# EAGLE design doubleSided-4x4 (EAGLE 9.0.0)
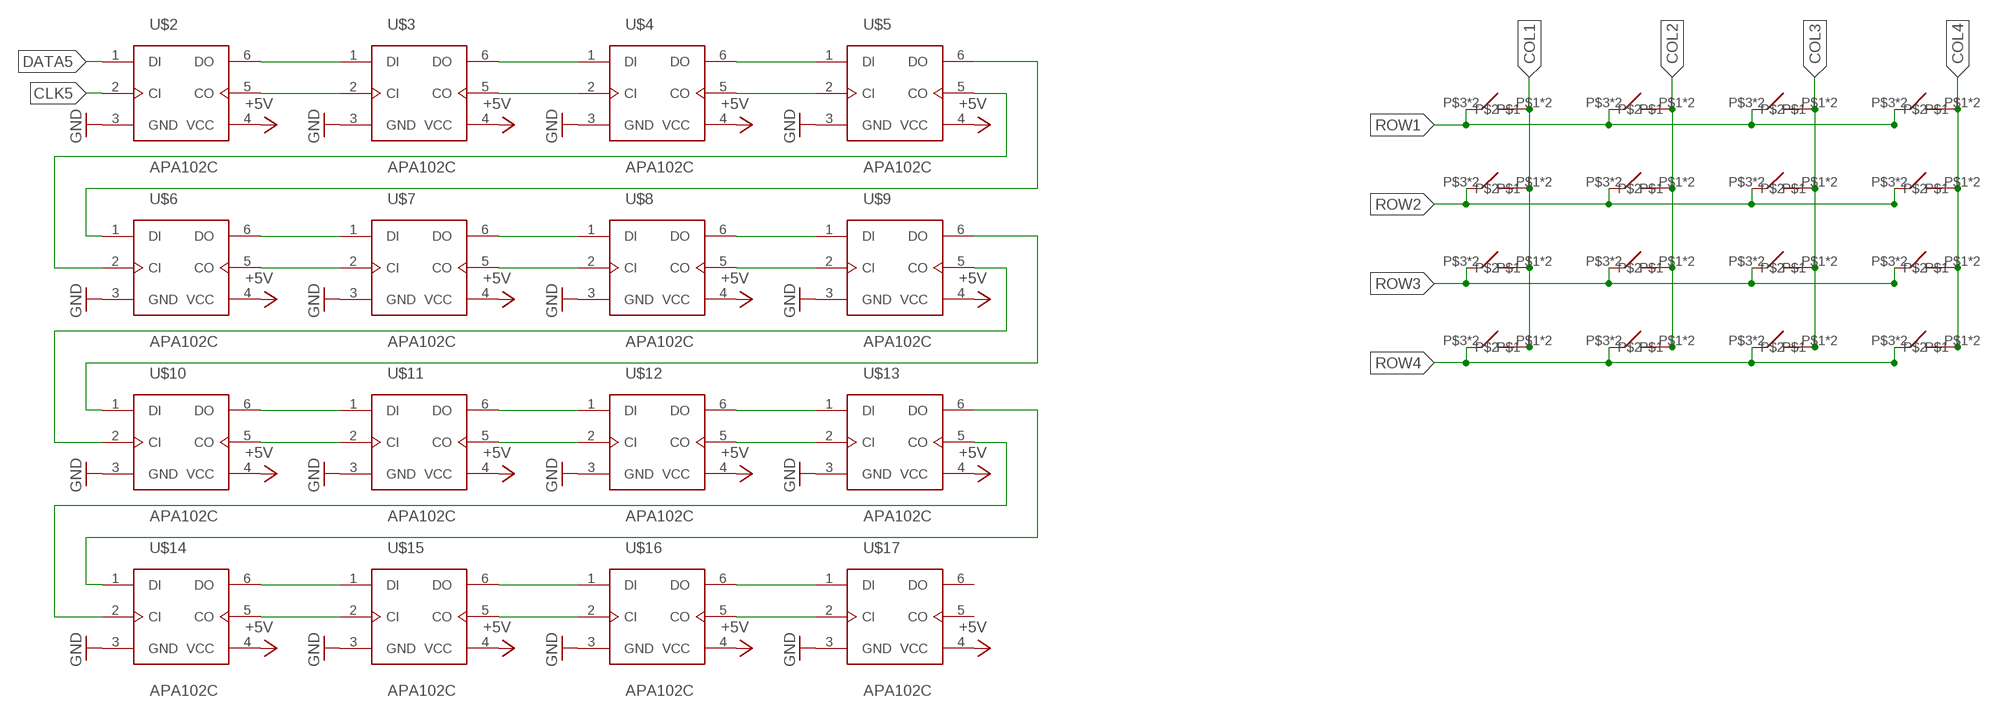
[diagram p0: schematic, sheet 1]

## Parts
U$2  APA102C  [APA102C-5050-SMD]
U$3  APA102C  [APA102C-5050-SMD]
U$4  APA102C  [APA102C-5050-SMD]
U$5  APA102C  [APA102C-5050-SMD]
U$6  APA102C  [APA102C-5050-SMD]
U$7  APA102C  [APA102C-5050-SMD]
U$8  APA102C  [APA102C-5050-SMD]
U$9  APA102C  [APA102C-5050-SMD]
U$10  APA102C  [APA102C-5050-SMD]
U$11  APA102C  [APA102C-5050-SMD]
U$12  APA102C  [APA102C-5050-SMD]
U$13  APA102C  [APA102C-5050-SMD]
U$14  APA102C  [APA102C-5050-SMD]
U$15  APA102C  [APA102C-5050-SMD]
U$16  APA102C  [APA102C-5050-SMD]
U$17  APA102C  [APA102C-5050-SMD]
U$18  SOFT-TACTILE-PUSHBUTTON  [ADAFRUIT-SOFT-TACTILE-PUSHBUTTON]
U$19  SOFT-TACTILE-PUSHBUTTON  [ADAFRUIT-SOFT-TACTILE-PUSHBUTTON]
U$20  SOFT-TACTILE-PUSHBUTTON  [ADAFRUIT-SOFT-TACTILE-PUSHBUTTON]
U$21  SOFT-TACTILE-PUSHBUTTON  [ADAFRUIT-SOFT-TACTILE-PUSHBUTTON]
U$22  SOFT-TACTILE-PUSHBUTTON  [ADAFRUIT-SOFT-TACTILE-PUSHBUTTON]
U$23  SOFT-TACTILE-PUSHBUTTON  [ADAFRUIT-SOFT-TACTILE-PUSHBUTTON]
U$24  SOFT-TACTILE-PUSHBUTTON  [ADAFRUIT-SOFT-TACTILE-PUSHBUTTON]
U$25  SOFT-TACTILE-PUSHBUTTON  [ADAFRUIT-SOFT-TACTILE-PUSHBUTTON]
U$26  SOFT-TACTILE-PUSHBUTTON  [ADAFRUIT-SOFT-TACTILE-PUSHBUTTON]
U$27  SOFT-TACTILE-PUSHBUTTON  [ADAFRUIT-SOFT-TACTILE-PUSHBUTTON]
U$28  SOFT-TACTILE-PUSHBUTTON  [ADAFRUIT-SOFT-TACTILE-PUSHBUTTON]
U$29  SOFT-TACTILE-PUSHBUTTON  [ADAFRUIT-SOFT-TACTILE-PUSHBUTTON]
U$30  SOFT-TACTILE-PUSHBUTTON  [ADAFRUIT-SOFT-TACTILE-PUSHBUTTON]
U$31  SOFT-TACTILE-PUSHBUTTON  [ADAFRUIT-SOFT-TACTILE-PUSHBUTTON]
U$32  SOFT-TACTILE-PUSHBUTTON  [ADAFRUIT-SOFT-TACTILE-PUSHBUTTON]
U$33  SOFT-TACTILE-PUSHBUTTON  [ADAFRUIT-SOFT-TACTILE-PUSHBUTTON]

## Nets
5V: U$2.4(VCC) U$3.4(VCC) U$4.4(VCC) U$5.4(VCC) U$6.4(VCC) U$7.4(VCC) U$8.4(VCC) U$9.4(VCC) U$10.4(VCC) U$11.4(VCC) U$12.4(VCC) U$13.4(VCC) U$14.4(VCC) U$15.4(VCC) U$16.4(VCC) U$17.4(VCC) ; supply symbol labelled +5V
CLK5: U$2.2(CI)
COL1: U$18.P$1 U$18.P$2 U$22.P$1 U$22.P$2 U$26.P$1 U$26.P$2 U$30.P$1 U$30.P$2
COL2: U$19.P$1 U$19.P$2 U$23.P$1 U$23.P$2 U$27.P$1 U$27.P$2 U$31.P$1 U$31.P$2
COL3: U$20.P$1 U$20.P$2 U$24.P$1 U$24.P$2 U$28.P$1 U$28.P$2 U$32.P$1 U$32.P$2
COL4: U$21.P$1 U$21.P$2 U$25.P$1 U$25.P$2 U$29.P$1 U$29.P$2 U$33.P$1 U$33.P$2
DATA5: U$2.1(DI)
GND: U$2.3(GND) U$3.3(GND) U$4.3(GND) U$5.3(GND) U$6.3(GND) U$7.3(GND) U$8.3(GND) U$9.3(GND) U$11.3(GND) U$12.3(GND) U$13.3(GND) U$15.3(GND) U$16.3(GND) U$17.3(GND)
N$1: U$2.6(DO) U$3.1(DI)
N$2: U$2.5(CO) U$3.2(CI)
N$3: U$3.5(CO) U$4.2(CI)
N$4: U$3.6(DO) U$4.1(DI)
N$5: U$4.6(DO) U$5.1(DI)
N$6: U$4.5(CO) U$5.2(CI)
N$7: U$6.6(DO) U$7.1(DI)
N$8: U$6.5(CO) U$7.2(CI)
N$9: U$7.5(CO) U$8.2(CI)
N$10: U$7.6(DO) U$8.1(DI)
N$11: U$8.6(DO) U$9.1(DI)
N$12: U$8.5(CO) U$9.2(CI)
N$13: U$5.5(CO) U$6.2(CI)
N$14: U$5.6(DO) U$6.1(DI)
N$15: U$10.6(DO) U$11.1(DI)
N$16: U$10.5(CO) U$11.2(CI)
N$17: U$11.5(CO) U$12.2(CI)
N$18: U$11.6(DO) U$12.1(DI)
N$19: U$12.6(DO) U$13.1(DI)
N$20: U$12.5(CO) U$13.2(CI)
N$21: U$14.6(DO) U$15.1(DI)
N$22: U$14.5(CO) U$15.2(CI)
N$23: U$15.5(CO) U$16.2(CI)
N$24: U$15.6(DO) U$16.1(DI)
N$25: U$16.6(DO) U$17.1(DI)
N$26: U$16.5(CO) U$17.2(CI)
N$27: U$9.5(CO) U$10.2(CI)
N$28: U$9.6(DO) U$10.1(DI)
N$29: U$13.5(CO) U$14.2(CI)
N$30: U$13.6(DO) U$14.1(DI)
ROW1: U$18.P$3 U$18.P$4 U$19.P$3 U$19.P$4 U$20.P$3 U$20.P$4 U$21.P$3 U$21.P$4
ROW2: U$22.P$3 U$22.P$4 U$23.P$3 U$23.P$4 U$24.P$3 U$24.P$4 U$25.P$3 U$25.P$4
ROW3: U$26.P$3 U$26.P$4 U$27.P$3 U$27.P$4 U$28.P$3 U$28.P$4 U$29.P$3 U$29.P$4
ROW4: U$30.P$3 U$30.P$4 U$31.P$3 U$31.P$4 U$32.P$3 U$32.P$4 U$33.P$3 U$33.P$4
Unconnected: U$17.5(CO) U$17.6(DO)

## Power pins joined to a net without a drawn wire
GND: U$10.3(GND) U$14.3(GND)

## Library data of the parts
U$2-U$17 = launchpadParts:APA102C: APA201C RGB LED using the SPI interface. 5050 SMD package Sold by Adafruit as Dotstars Resources: Datasheet <https://cdn-shop.adafruit.com/datasheets/APA102.pdf>
U$18-U$33 = launchpadParts:SOFT-TACTILE-PUSHBUTTON: Soft Tactile Button Pushbutton from Adafruit

## Board
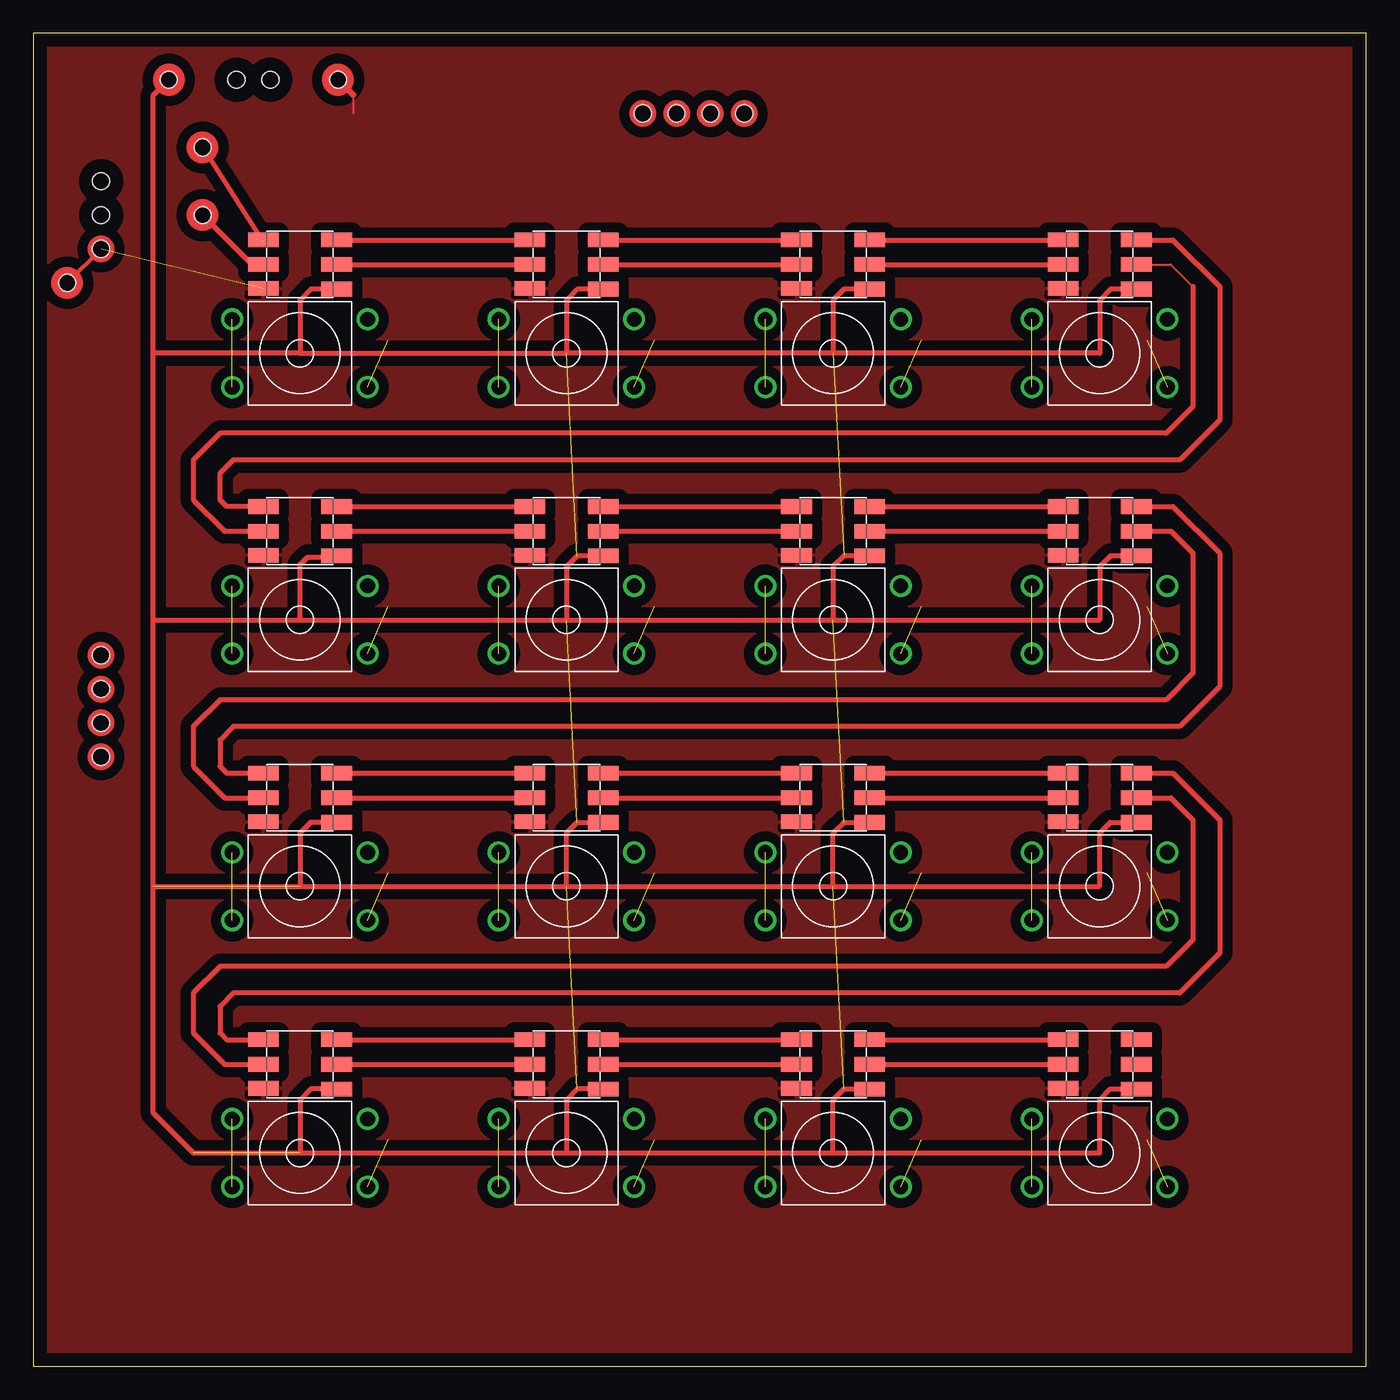
[diagram p1: board, top side]
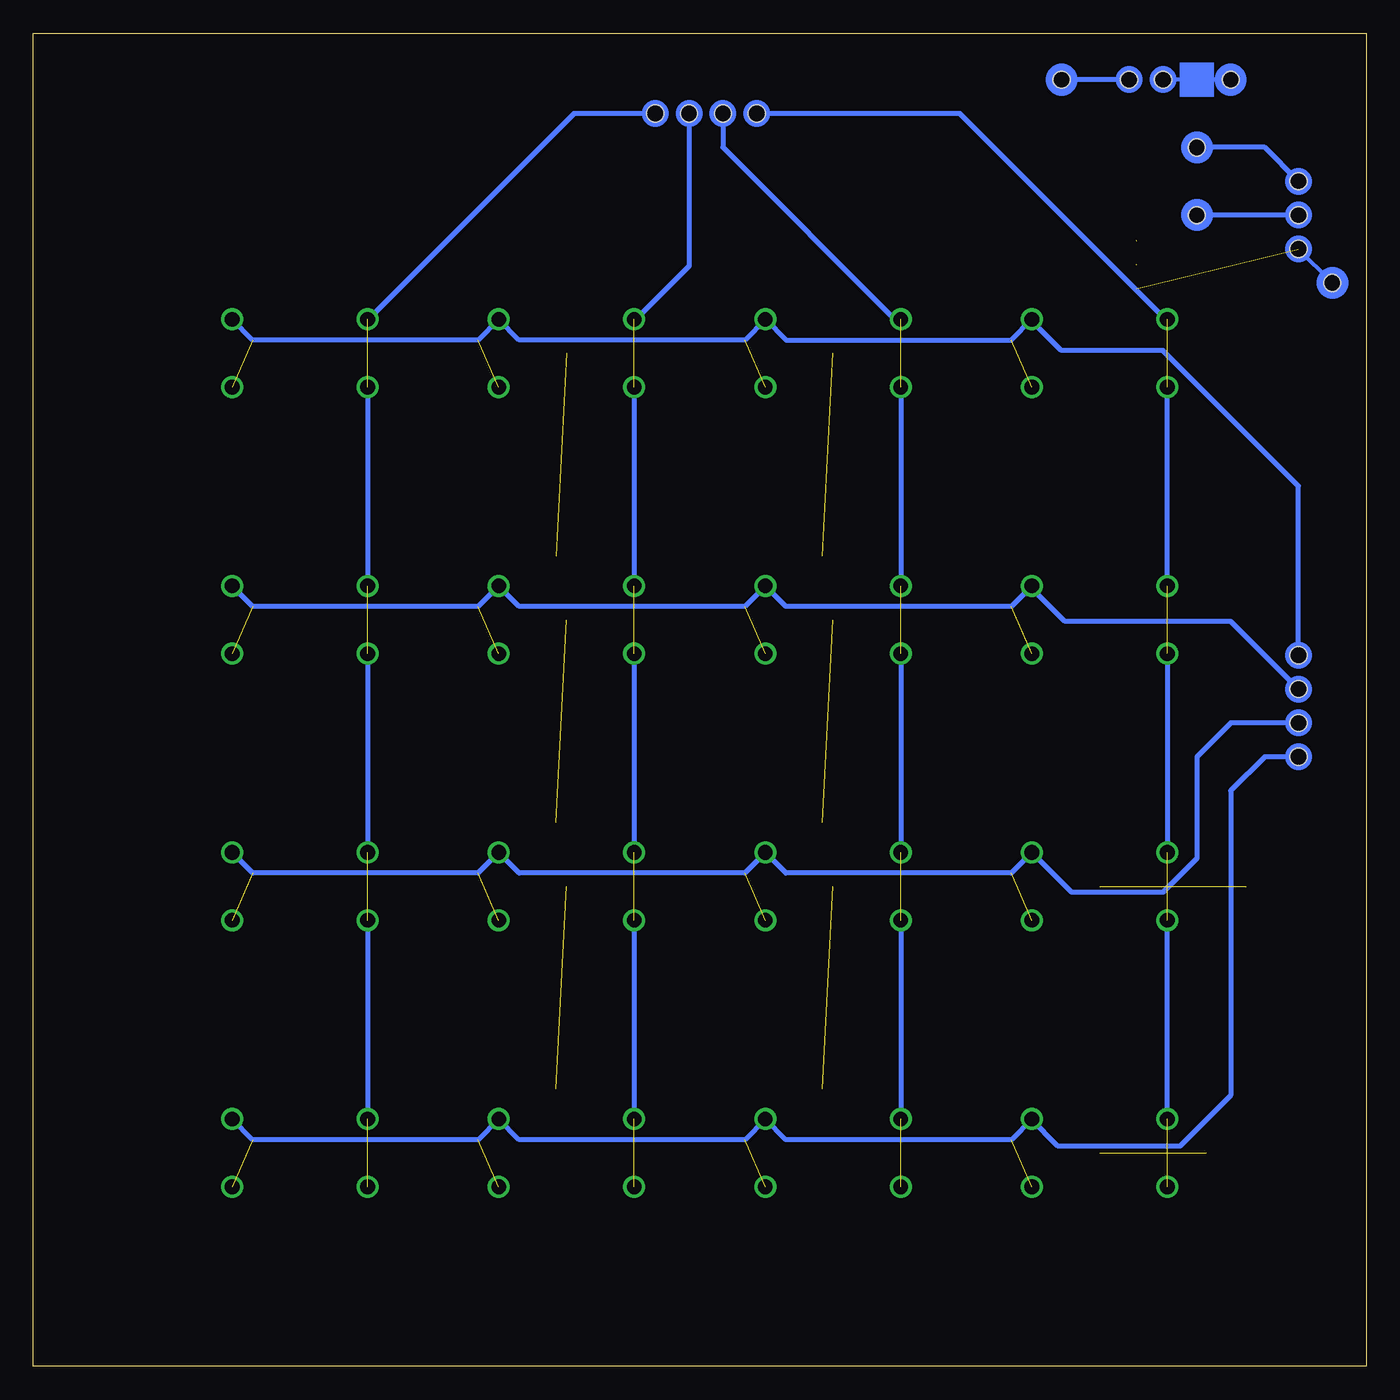
[diagram p2: board, bottom side, seen from below]

Size 100 x 100 mm. Coordinates in mm from the lower left corner, seen from the top.
Outline: 0,0 100,0 100,100 0,100 0,0
Copper layers (1*16): Top 0.035mm / dielectric 1.5mm / Bottom 0.035mm
Design rules "default *": minimum track width 6mil, minimum drill 0.35mm, track to track 30mil, track to pad 27mil, pad to pad 20mil, via to via 6mil, smd to smd 6mil, copper to edge 40mil, drill to drill 6mil, minimum pad ring 10mil, minimum via ring 8mil, stop-mask expansion 4mil, vias tented up to drill 0mil, thermal gap 10mil
Holes 1.27 mm at 53.34,93.98 5.08,53.34 5.08,50.8 50.8,93.98 48.26,93.98 45.72,93.98 5.08,45.72 5.08,48.26 15.24,96.52 17.78,96.52 5.08,88.9 5.08,86.36 5.08,83.82 10.16,96.52 22.86,96.52 12.7,91.44 12.7,86.36 2.54,81.28

### Footprints (pad centres in the part's own frame; a part is rotated, then mirrored left to right if it is on the bottom)
APA102C-5050-SMD = smd 2.3 x 1.1: 1 -2.75,1.85; 2 -2.75,0; 3 -2.75,-1.8; 4 2.75,-1.85; 5 2.75,0; 6 2.75,1.85
ADAFRUIT-SOFT-TACTILE-PUSHBUTTON = drill 1.1: P$1 -5.08,2.54; P$2 -5.08,-2.54; P$3 5.08,-2.54; P$4 5.08,2.54

### Placement (x,y rotation side)
U$2  20,82.65 0 top
U$3  40,82.65 0 top
U$4  60,82.65 0 top
U$5  80,82.65 0 top
U$6  20,62.65 0 top
U$7  40,62.65 0 top
U$8  60,62.65 0 top
U$9  80,62.65 0 top
U$10  20,42.65 0 top
U$11  40,42.65 0 top
U$12  60,42.65 0 top
U$13  80,42.65 0 top
U$14  20,22.65 0 top
U$15  40,22.65 0 top
U$16  60,22.65 0 top
U$17  80,22.65 0 top
U$18  20,76 0 top
U$19  40,76 0 top
U$20  60,76 0 top
U$21  80,76 0 top
U$22  20,56 0 top
U$23  40,56 0 top
U$24  60,56 0 top
U$25  80,56 0 top
U$26  20,36 0 top
U$27  40,36 0 top
U$28  60,36 0 top
U$29  80,36 0 top
U$30  20,16 0 top
U$31  40,16 0 top
U$32  60,16 0 top
U$33  80,16 0 top

### Tracks (layer width: path | path; a pad name or v marks a point on that pad's centre or on a via)
5V  (via drill 0.35)  (8 unrouted)
  Top 0.152: U$6.4 20.8,60.8 20,60
  Top 0.381: U$2.4 20.8,80.8 20,80 20,76 | 20,76 40,76 | 40,76 40,80 40.8,80.8 U$3.4 | U$4.4 60.8,80.8 60,80 60,76 | 60,76 40,76 | 60,76 80,76 80,80 80.8,80.8 U$5.4 | U$9.4 80.8,60.8 80,60 80,56 20,56 | U$8.4 60.8,60.8 60,60 60,56 | U$7.4 40.8,60.8 40,60 40,56 | U$10.4 20.8,40.8 20,40 20,36 | U$13.4 80.8,40.8 80,40 80,36 9,36 | 60,36 60,40 60.8,40.8 U$12.4 | 40,36 40,40 40.8,40.8 U$11.4 | U$14.4 20.8,20.8 20,20 20,16 | U$17.4 80.8,20.8 80,20 80,16 12,16 9,19 9,36 | 60,16 60,20 60.8,20.8 U$16.4 | U$15.4 40.8,20.8 40,20 40,16 | 9,36 9,56 | 9,56 9,76 | 9,76 9,95.36 v10.16,96.52 | 20,76 9,76 | 9,56 20,56 | 20,56 20,60 20,60.13 20.57,60.71 22.61,60.71
  Bottom 0.3: v10.16,96.52 15.24,96.52
  pour Bottom: 11.43,97.79 11.43,95.25 13.97,95.25 13.97,97.79
CLK5  (via drill 0.35)  (1 unrouted)
  Top 0.152: 16.46,82.6 17.2,82.6
  Top 0.381: v12.7,86.36 16.46,82.6
  Bottom 0.381: 5.08,86.36 v12.7,86.36
COL1  (4 unrouted)
  Bottom 0.381: U$30.P$1 U$26.P$2 | U$22.P$2 U$26.P$1 | U$22.P$1 U$18.P$2
COL2  (4 unrouted)
  Bottom 0.381: U$19.P$2 U$23.P$1 | U$27.P$2 U$31.P$1 | U$23.P$2 U$27.P$1
COL3  (4 unrouted)
  Bottom 0.381: U$20.P$2 U$24.P$1 | U$28.P$2 U$32.P$1 | U$24.P$2 U$28.P$1
COL4  (4 unrouted)
  Bottom 0.381: U$21.P$2 U$25.P$1 | U$29.P$2 U$33.P$1 | U$25.P$2 U$29.P$1
DATA5  (via drill 0.35)  (1 unrouted)
  Top 0.381: v12.7,91.44 17.2,84.4
  Bottom 0.381: 5.08,88.9 7.62,91.44 v12.7,91.44
GND  (via drill 0.35)  (1 unrouted)
  Top 0.152: 24,95.38 24,94
  Top 0.3: 5.08,83.82 v2.54,81.28
  Top 0.5: v22.86,96.52 24,95.38
  Bottom 0.3: v2.54,81.28 5.08,83.82
  Bottom 0.381: 17.78,96.52 v22.86,96.52
  pour Top: -1,0 0,-1 100,-1 101,0 101,100 100,101 0,101 -1,100
N$1
  Top 0.381: U$2.6 U$3.1
N$2
  Top 0.381: U$2.5 U$3.2
N$3
  Top 0.381: U$3.5 U$4.2
N$4
  Top 0.381: U$3.6 U$4.1
N$5
  Top 0.381: U$4.6 U$5.1
N$6
  Top 0.381: U$4.5 U$5.2
N$7
  Top 0.381: U$6.6 U$7.1
N$8
  Top 0.381: U$6.5 U$7.2
N$9
  Top 0.381: U$7.5 U$8.2
N$10
  Top 0.381: U$7.6 U$8.1
N$11
  Top 0.381: U$8.6 U$9.1
N$12
  Top 0.381: U$8.5 U$9.2
N$13
  Top 0.152: U$5.5 85.35,82.65 87,81
  Top 0.381: 87,81 87,72 85,70 14,70 12,68 12,65 14.35,62.65 U$6.2
N$14
  Top 0.381: U$5.6 85.5,84.5 89,81 89,71 86,68 15,68 14,67 14,65 14.5,64.5 U$6.1
N$15
  Top 0.381: U$10.6 U$11.1
N$16
  Top 0.381: U$10.5 U$11.2
N$17
  Top 0.381: U$11.5 U$12.2
N$18
  Top 0.381: U$11.6 U$12.1
N$19
  Top 0.381: U$12.6 U$13.1
N$20
  Top 0.381: U$12.5 U$13.2
N$21
  Top 0.381: U$14.6 U$15.1
N$22
  Top 0.381: U$14.5 U$15.2
N$23
  Top 0.381: U$15.5 U$16.2
N$24
  Top 0.381: U$15.6 U$16.1
N$25
  Top 0.381: U$16.6 U$17.1
N$26
  Top 0.381: U$16.5 U$17.2
N$27
  Top 0.381: U$9.5 85.35,62.65 87,61 87,52 85,50 14,50 12,48 12,45 14.35,42.65 U$10.2
N$28
  Top 0.381: U$9.6 85.5,64.5 89,61 89,51 86,48 15,48 14,47 14,45 14.5,44.5 U$10.1
N$29
  Top 0.381: U$13.5 85.35,42.65 87,41 87,32 85,30 14,30 12,28 12,25 14.35,22.65 U$14.2
N$30
  Top 0.381: U$13.6 85.5,44.5 89,41 89,31 86,28 15,28 14,27 14,25 14.5,24.5 U$14.1
N$31
  Bottom 0.381: 25.15,78.49 22.86,76.2 15.24,76.2 5.08,66.04 5.08,53.34
N$32
  Bottom 0.381: 15.24,78.74 30.48,93.98 45.72,93.98
N$33
  Bottom 0.381: 48.26,93.98 48.26,91.44 35.31,78.49 35.05,78.49
N$34
  Bottom 0.381: 50.8,93.98 50.8,82.55 54.86,78.49
N$35
  Bottom 0.381: 25.15,58.42 22.61,55.88 10.16,55.88 5.08,50.8
N$36
  Bottom 0.381: 53.34,93.98 59.44,93.98 74.93,78.49
N$37
  Bottom 0.381: 5.08,45.72 7.62,45.72 10.16,43.18 10.16,20.32 13.97,16.51 23.11,16.51 25.15,18.54
N$39
  Bottom 0.381: 5.08,48.26 10.16,48.26 12.7,45.72 12.7,38.1 15.24,35.56 22.1,35.56 25.15,38.61
ROW1  (4 unrouted)
  Bottom 0.381: U$18.P$4 26.62,77 43.54,77 U$19.P$4 46.62,77 63.54,77 U$20.P$4 66.62,77 83.54,77 U$21.P$4
ROW2  (4 unrouted)
  Bottom 0.381: U$22.P$4 26.62,57 43.54,57 U$23.P$4 46.62,57 63.54,57 U$24.P$4 66.62,57 83.54,57 U$25.P$4
ROW3  (4 unrouted)
  Bottom 0.381: U$26.P$4 26.62,37 43.54,37 U$27.P$4 46.62,37 63.54,37 U$28.P$4 66.62,37 83.54,37 U$29.P$4
ROW4  (4 unrouted)
  Bottom 0.381: U$30.P$4 26.62,17 43.54,17 U$31.P$4 46.62,17 63.54,17 U$32.P$4 66.62,17 83.54,17 U$33.P$4
(copper drawn outside any net)
  shapes: Bottom area x1, Bottom circle x18, Top circle x14